# EAGLE design cpu (EAGLE 7.0.0)
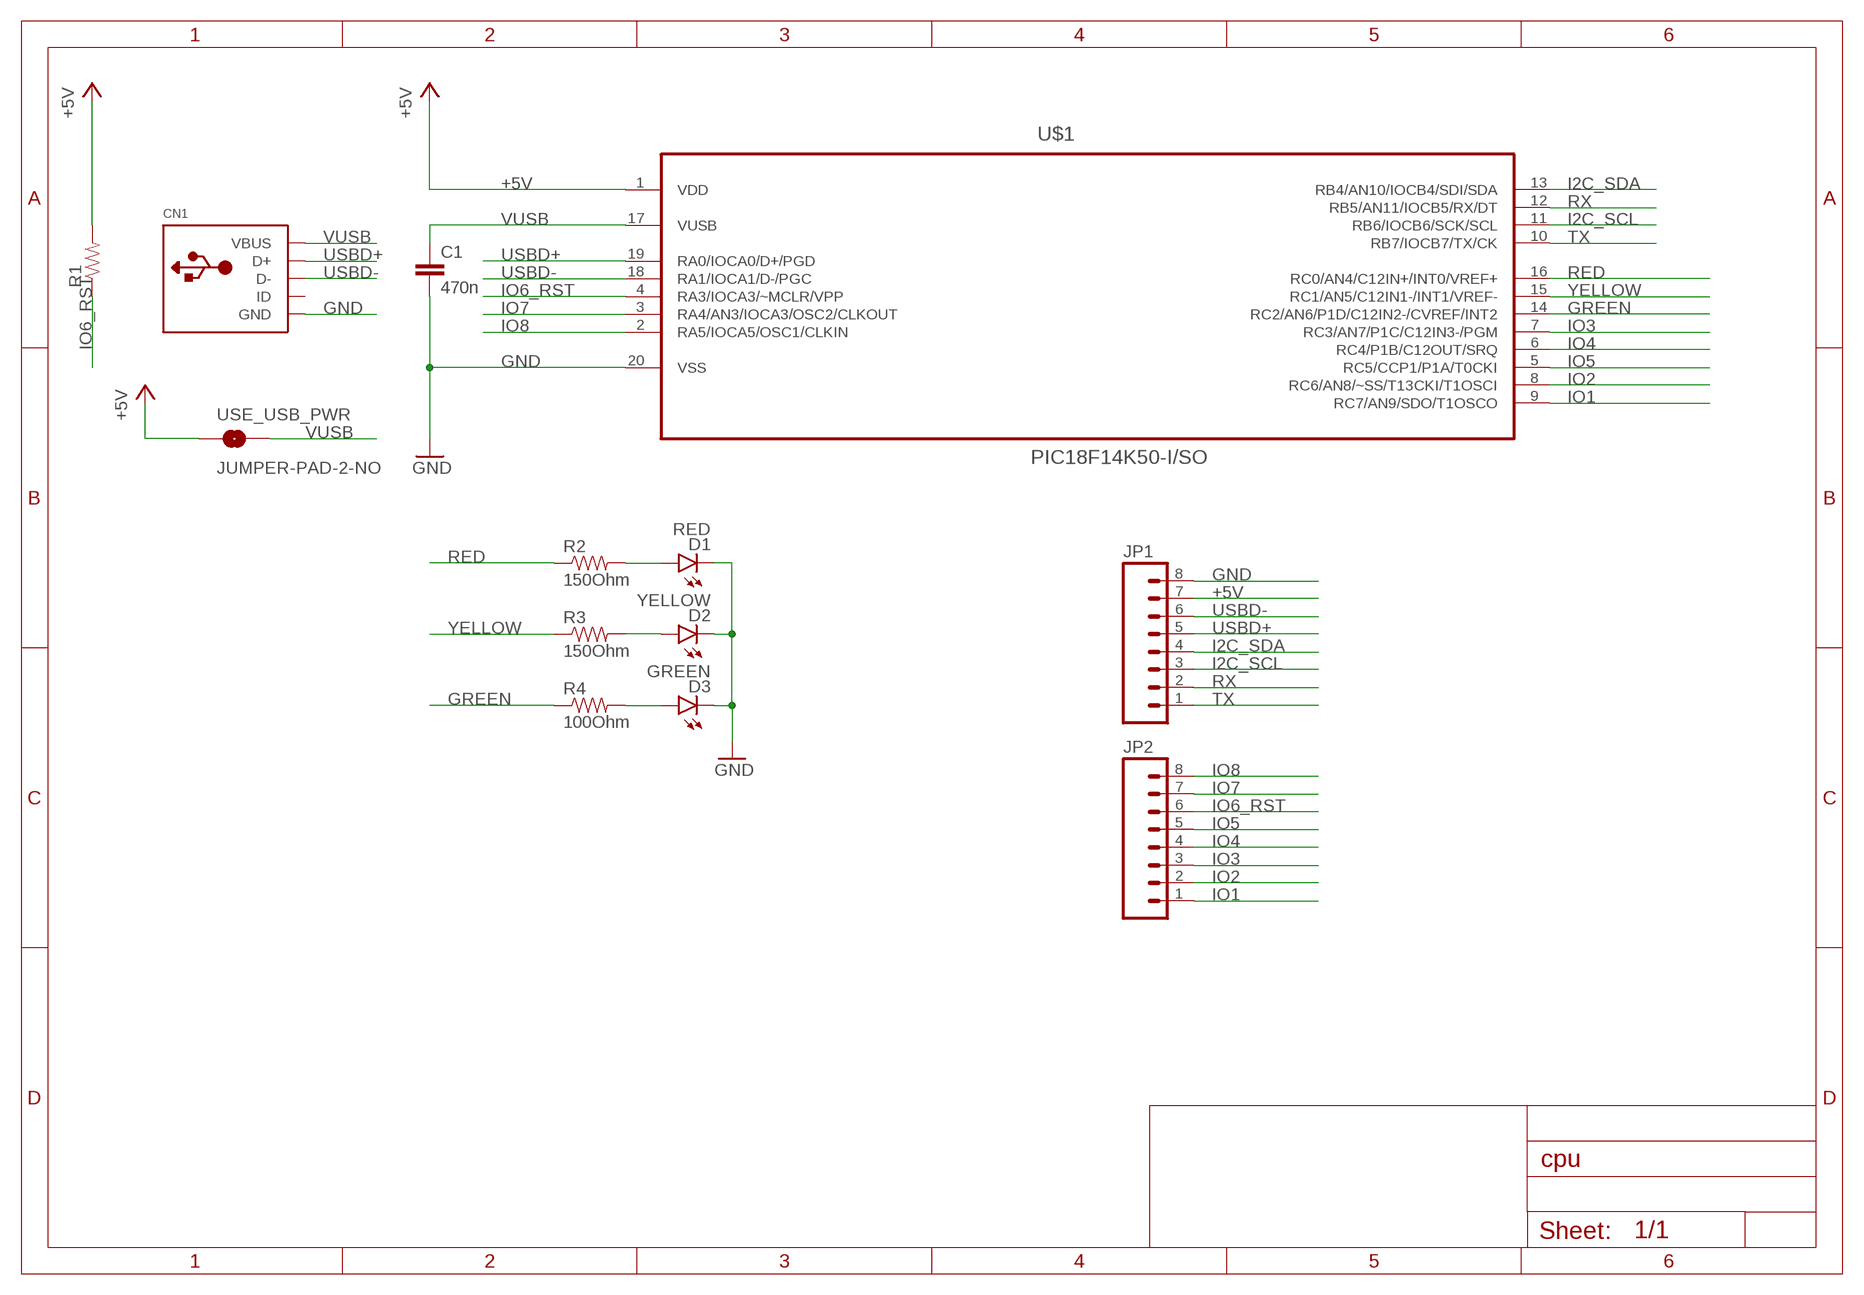
[diagram p0: schematic, sheet 1]

## Parts
C1  470n  C-EUC0805K  [C0805K]
CN1  USBMINIB  [USB-MINIB]
D1  RED  LED-RED0603  [LED-0603]
D2  YELLOW  LED-YELLOW0603  [LED-0603]
D3  GREEN  LED-GREEN0603  [LED-0603]
JP1  M081X08  [1X08]
JP2  M081X08  [1X08]
R1  RESISTOR0402-RES  [0402-RES]
R2  150Ohm  RESISTOR0402-RES  [0402-RES]
R3  150Ohm  RESISTOR0402-RES  [0402-RES]
R4  100Ohm  RESISTOR0402-RES  [0402-RES]
U$1  PIC18F14K50-I/SO  [SOIC127P1030X265-20N]
USE_USB_PWR  JUMPER-PAD-2-NO  [PAD-JUMPER-2-NO_NO_SILK]

## Nets
+5V: JP1.7 R1.2 U$1.1(VDD) USE_USB_PWR.1
GND: C1.2 CN1.GND D1.C D2.C D3.C JP1.8 U$1.20(VSS)
GREEN: R4.1 U$1.14(RC2/AN6/P1D/C12IN2-/CVREF/INT2)
I2C_SCL: JP1.3 U$1.11(RB6/IOCB6/SCK/SCL)
I2C_SDA: JP1.4 U$1.13(RB4/AN10/IOCB4/SDI/SDA)
IO1: JP2.1 U$1.9(RC7/AN9/SDO/T1OSCO)
IO2: JP2.2 U$1.8(RC6/AN8/~SS/T13CKI/T1OSCI)
IO3: JP2.3 U$1.7(RC3/AN7/P1C/C12IN3-/PGM)
IO4: JP2.4 U$1.6(RC4/P1B/C12OUT/SRQ)
IO5: JP2.5 U$1.5(RC5/CCP1/P1A/T0CKI)
IO6_RST: JP2.6 R1.1 U$1.4(RA3/IOCA3/~MCLR/VPP)
IO7: JP2.7 U$1.3(RA4/AN3/IOCA3/OSC2/CLKOUT)
IO8: JP2.8 U$1.2(RA5/IOCA5/OSC1/CLKIN)
N$1: D1.A R2.2
N$2: D2.A R3.2
N$3: D3.A R4.2
RED: R2.1 U$1.16(RC0/AN4/C12IN+/INT0/VREF+)
RX: JP1.2 U$1.12(RB5/AN11/IOCB5/RX/DT)
TX: JP1.1 U$1.10(RB7/IOCB7/TX/CK)
USBD+: CN1.D+ JP1.5 U$1.19(RA0/IOCA0/D+/PGD)
USBD-: CN1.D- JP1.6 U$1.18(RA1/IOCA1/D-/PGC)
VUSB: C1.1 CN1.VBUS U$1.17(VUSB) USE_USB_PWR.2
YELLOW: R3.1 U$1.15(RC1/AN5/C12IN1-/INT1/VREF-)
Unconnected: CN1.ID

## Library data of the parts
C1 = rcl:C-EU: CAPACITOR, European symbol
CN1 = adafruit:USB: USB Connectors USBMINIB - Surface Mount Female Mini-B USB Connector 4UConnector: 06564 By microbuilder.eu Thru-hole RA Female Mini-B USB Connector 4UConnector: 18732 By ladyada.net
D1 = SparkFun-LED:LED-RED: Assorted Red LEDs LilyPad 1206- DIO-09912 1206- DIO-00809 0603- DIO-00819; PROD_ID: DIO-00819
D2 = SparkFun-LED:LED-YELLOW: Yellow SMD LEDs LilyPad 1206- DIO-09909 0603- DIO-09003; PROD_ID: DIO-09003
D3 = SparkFun-LED:LED-GREEN: Various green LEDs Green LEDs used in SFE Production 0603- DIO-00821 LARGE- DIO-00862 LILYPAD- DIO-09910; PROD_ID: DIO-00821
JP1 JP2 = SparkFun-Connectors:M08: Header 8 Standard 8-pin 0.1" header. Use with straight break away headers (SKU : PRT-00116), right angle break away headers (PRT-00553), swiss pins (PRT-00743), machine pins (PRT-00117), and female headers (PRT-00115).
R1-R4 = SparkFun-Passives:RESISTOR: Resistor Basic schematic elements and footprints for 0603, 1206, and PTH resistors.
U$1 = Microchip_By_element14_Batch_1:PIC18F14K50-I/SO: USB Flash Microcontrollers; DESCRIPTION: Microcontrollers; MPN: PIC18F14K50-I/SO; OC_FARNELL: 1648502; OC_NEWARK: 77M3104; PACKAGE: SOIC-20; SUPPLIER: Microchip
USE_USB_PWR = SparkFun-Passives:JUMPER-PAD-2-NO

## Board
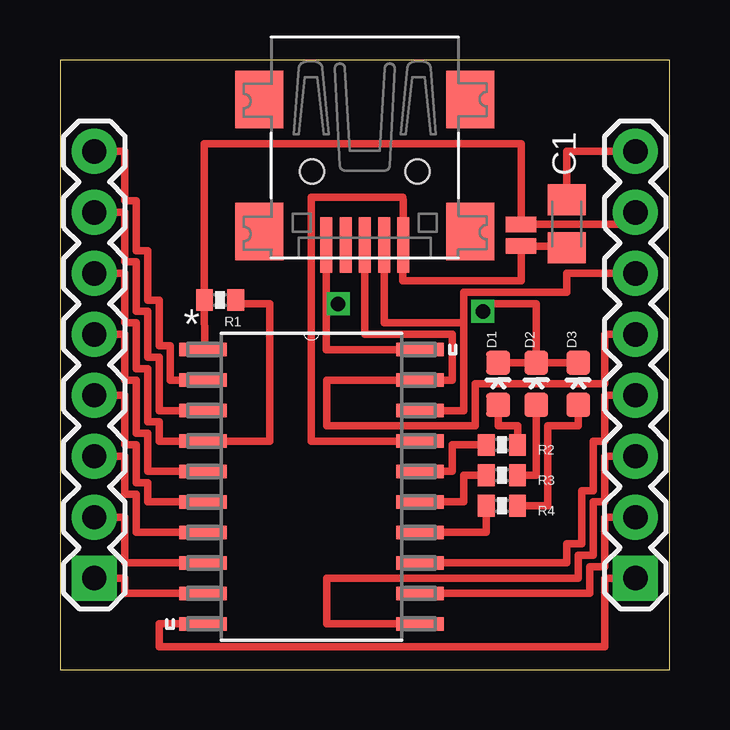
[diagram p1: board, top side]
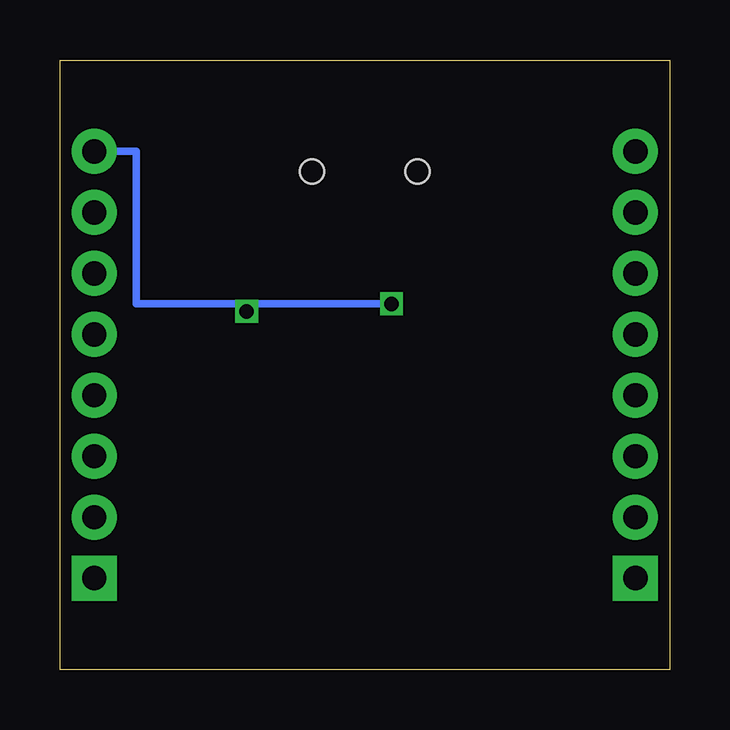
[diagram p2: board, bottom side, seen from below]

Size 25.4 x 25.4 mm. Coordinates in mm from the lower left corner, seen from the top.
Outline: 0,0 25.4,0 25.4,25.4 0,25.4 0,0
Copper layers (1*16): Top 0.0356mm / dielectric 1.5011mm / Bottom 0.0356mm
Design rules "LaenPCBOrder": minimum track width 6mil, minimum drill 13mil, track to track 6mil, track to pad 6mil, pad to pad 6mil, via to via 6mil, smd to smd 6mil, copper to edge 15mil, drill to drill 6mil, minimum pad ring 7mil, minimum via ring 7mil, stop-mask expansion 3mil, vias tented up to drill 0mil, thermal gap 10mil

### Footprints (pad centres in the part's own frame; a part is rotated, then mirrored left to right if it is on the bottom)
C0805K = smd 1.3 x 1.6: 1 -1,0; 2 1,0
USB-MINIB = smd 0.5 x 2.308: D+ 0,4.064; D- -0.8,4.064; GND 1.6,4.064; ID 0.8,4.064; VBUS -1.6,4.064 | smd 2 x 2.4: GND1 -4.4,-2; GND2 -4.4,3.5; GND3 4.4,3.5; GND4 4.4,-2 | hole 1: -2.2,1; 2.2,1
LED-0603 = smd 1 x 1: A 0,-0.877; C 0,0.877
1X08 = drill 1.016 pad 1.88 square: 1 0,0 | drill 1.016 pad 1.88: 2 2.54,0; 3 5.08,0; 4 7.62,0; 5 10.16,0; 6 12.7,0; 7 15.24,0; 8 17.78,0
0402-RES = smd 0.7 x 0.9: 1 -0.65,0; 2 0.65,0
SOIC127P1030X265-20N = smd 1.981 x 0.559: 1 -4.521,5.715; 2 -4.521,4.445; 3 -4.521,3.175; 4 -4.521,1.905; 5 -4.521,0.635; 6 -4.521,-0.635; 7 -4.521,-1.905; 8 -4.521,-3.175; 9 -4.521,-4.445; 10 -4.521,-5.715; 11 4.521,-5.715; 12 4.521,-4.445; 13 4.521,-3.175; 14 4.521,-1.905; 15 4.521,-0.635; 16 4.521,0.635; 17 4.521,1.905; 18 4.521,3.175; 19 4.521,4.445; 20 4.521,5.715
PAD-JUMPER-2-NO_NO_SILK = smd 0.635 x 1.27: 1 -0.45,0; 2 0.45,0

### Placement (x,y rotation side)
C1  21.11,18.57 90 top
CN1  12.7,21.75 180 top
D1  18.26,11.91 0 top
D2  19.84,11.91 0 top
D3  21.59,11.91 0 top
JP1  23.97,3.81 90 top
JP2  1.43,3.81 90 top
R1  6.67,15.4 180 top
R2  18.41,9.37 0 top
R3  18.41,8.1 0 top
R4  18.41,6.83 0 top
U$1  10.48,7.62 0 top
USE_USB_PWR  19.21,18.1 270 top

### Tracks (layer width: path | path; a pad name or v marks a point on that pad's centre or on a via)
+5V
  Top 0.305: 6.03,13.34 U$1.1 6.04,13.34 R1.2 6.02,21.91 19.21,21.91 USE_USB_PWR.1 23.97,18.55 JP1.7
GND  (via drill 0.6)
  Top 0.305: U$1.20 11.1,13.34 11.1,15.24 | 11.1,15.24 CN1.GND 11.11,17.68 | JP1.8 21.11,21.59 C1.2 | D1.C D2.C | D2.C D3.C | D2.C 19.84,15.24 17.78,15.24 v17.62,14.92 | v11.59,15.24 11.1,15.24
  Bottom 0.305: v17.62,14.92 17.46,15.24 | 17.46,15.24 v11.59,15.24 | 17.46,15.24 22.23,15.24 22.23,21.59 JP1.8
GREEN
  Top 0.305: U$1.14 17.77,5.71 R4.1
I2C_SCL
  Top 0.305: U$1.11 11.11,1.91 11.11,3.81 21.59,3.81 21.59,4.76 22.23,4.76 22.23,6.99 22.7,6.99 22.7,8.89 JP1.3
I2C_SDA
  Top 0.305: U$1.13 21.11,4.45 21.11,5.24 21.75,5.24 21.75,7.46 22.23,7.46 22.23,9.53 22.7,9.53 22.7,11.43 JP1.4
IO1
  Top 0.305: U$1.9 2.7,3.17 2.7,3.81 JP2.1
IO2
  Top 0.305: JP2.2 2.7,6.35 2.7,4.45 U$1.8
IO3
  Top 0.305: JP2.3 2.7,8.89 2.7,7.3 3.17,7.3 3.17,5.71 U$1.7
IO4
  Top 0.305: JP2.4 2.7,11.43 2.7,9.37 3.17,9.37 3.17,7.78 3.65,7.78 3.65,6.99 U$1.6
IO5
  Top 0.305: JP2.5 2.7,13.97 2.7,12.06 3.17,12.06 3.17,9.84 3.65,9.84 3.65,8.26 U$1.5
IO6_RST
  Top 0.305: JP2.6 2.7,16.51 2.7,14.45 3.17,14.45 3.17,12.54 3.65,12.54 3.65,10.32 4.13,10.32 4.13,9.53 U$1.4 8.73,9.53 8.73,15.24 7.3,15.24 R1.1
IO7
  Top 0.305: U$1.3 4.13,10.79 4.13,13.02 3.65,13.02 3.65,14.92 3.17,14.92 3.17,16.99 2.7,16.99 2.7,19.05 JP2.7
IO8
  Top 0.305: U$1.2 4.6,12.06 4.6,13.49 4.13,13.49 4.13,15.4 3.65,15.4 3.65,17.46 3.17,17.46 3.17,19.53 2.7,19.53 2.7,21.59 JP2.8
N$1
  Top 0.305: R2.2 19.07,10.16 18.26,10.16 D1.A
N$2
  Top 0.305: R3.2 19.84,8.1 D2.A
N$3
  Top 0.305: R4.2 20.32,6.83 20.32,10.16 21.59,10.16 D3.A
RED
  Top 0.305: U$1.16 16.35,8.26 16.35,9.37 R2.1
RX
  Top 0.305: U$1.12 22.07,3.17 22.07,4.29 22.7,4.29 22.7,6.35 JP1.2
TX
  Top 0.305: U$1.10 4.13,1.91 4.13,0.95 22.7,0.95 22.7,3.81 JP1.1
USBD+
  Top 0.305: CN1.D+ 12.7,13.97 16.35,13.97 16.35,12.06 U$1.19 11.11,12.06 11.11,10.16 17.3,10.16 17.3,11.91 22.7,11.91 22.7,13.97 JP1.5
USBD-
  Top 0.305: 16.83,14.45 13.5,14.45 CN1.D- | 16.83,14.45 16.83,10.79 U$1.18 | 16.83,14.45 16.83,15.72 21.11,15.72 21.11,16.51 JP1.6
VUSB
  Top 0.305: U$1.17 10.48,9.53 10.48,19.68 14.29,19.68 14.3,19.53 CN1.VBUS 14.29,17.68 14.29,16.19 19.21,16.19 USE_USB_PWR.2 21.11,17.65 C1.1
YELLOW
  Top 0.305: U$1.15 16.83,6.99 16.83,8.1 R3.1